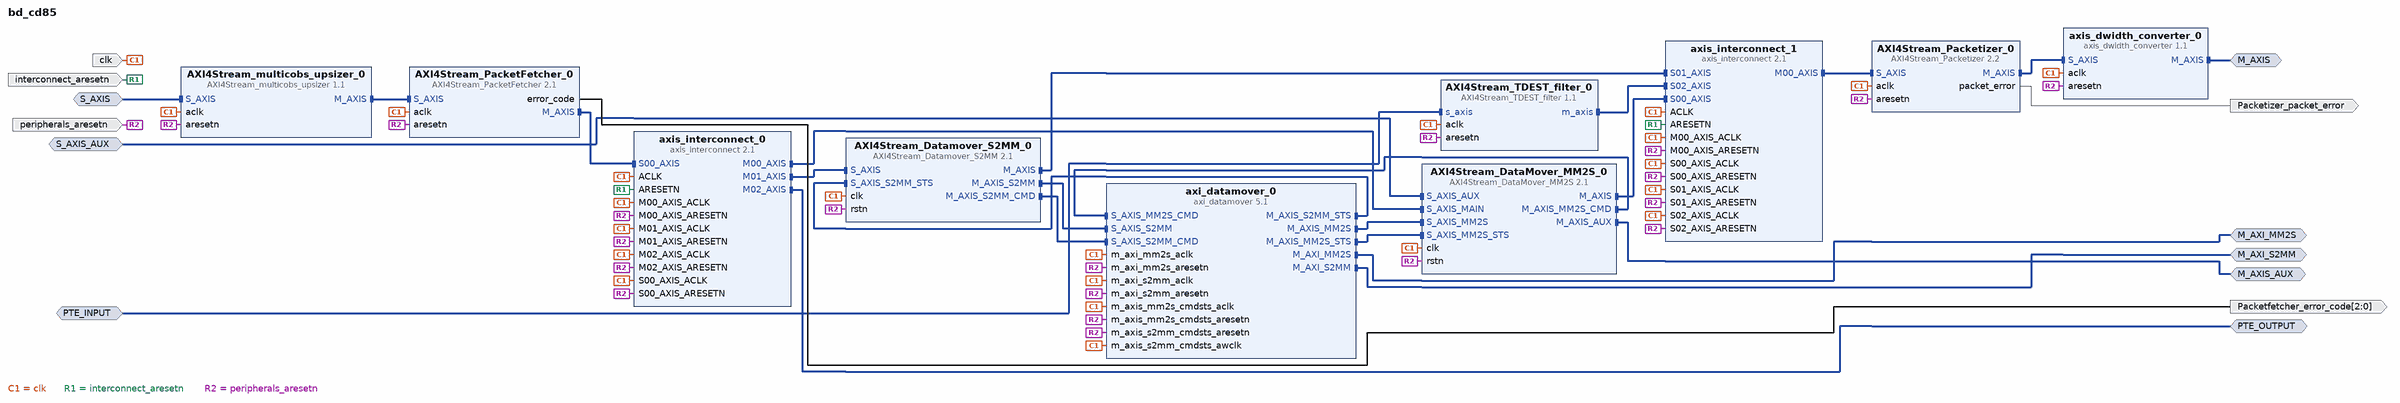
[diagram p0: block diagram of the top level]
# Vivado block design bd_cd85, xc7a100tftg256-2, Vivado 2020.2
create_bd_design bd_cd85

create_bd_intf_port -mode Slave -vlnv xilinx.com:interface:axis_rtl:1.0 S_AXIS
create_bd_intf_port -mode Slave -vlnv xilinx.com:interface:axis_rtl:1.0 S_AXIS_AUX
create_bd_intf_port -mode Master -vlnv xilinx.com:interface:axis_rtl:1.0 M_AXIS_AUX
create_bd_intf_port -mode Master -vlnv xilinx.com:interface:axis_rtl:1.0 M_AXIS
create_bd_intf_port -mode Master -vlnv xilinx.com:interface:aximm_rtl:1.0 M_AXI_MM2S
set_property -dict [list \
  CONFIG.ADDR_WIDTH 31 \
  CONFIG.MAX_BURST_LENGTH 256 \
  CONFIG.SUPPORTS_NARROW_BURST 0 \
] [get_bd_intf_ports M_AXI_MM2S]
create_bd_intf_port -mode Master -vlnv xilinx.com:interface:aximm_rtl:1.0 M_AXI_S2MM
set_property -dict [list \
  CONFIG.ADDR_WIDTH 31 \
  CONFIG.MAX_BURST_LENGTH 256 \
  CONFIG.SUPPORTS_NARROW_BURST 0 \
] [get_bd_intf_ports M_AXI_S2MM]
create_bd_intf_port -mode Master -vlnv xilinx.com:interface:axis_rtl:1.0 PTE_OUTPUT
create_bd_intf_port -mode Slave -vlnv xilinx.com:interface:axis_rtl:1.0 PTE_INPUT
create_bd_port -dir I -type clk clk
create_bd_port -dir I -type rst peripherals_aresetn
set_property -dict {CONFIG.POLARITY ACTIVE_LOW} [get_bd_ports peripherals_aresetn]
create_bd_port -dir I -type rst interconnect_aresetn
set_property -dict {CONFIG.POLARITY ACTIVE_LOW} [get_bd_ports interconnect_aresetn]
create_bd_port -dir O -from 2 -to 0 Packetfetcher_error_code
create_bd_port -dir O Packetizer_packet_error

create_bd_cell -type ip -vlnv DigiLAB:ip:AXI4Stream_DataMover_MM2S:2.1 AXI4Stream_DataMover_MM2S_0
set_property -dict [list \
  CONFIG.C_M_AXIS_MAIN_TDEST_WIDTH 8 \
  CONFIG.C_S_AXIS_MAIN_TDEST_WIDTH 8 \
  CONFIG.TDEST_ROUTING 0 \
] [get_bd_cells AXI4Stream_DataMover_MM2S_0]
create_bd_cell -type ip -vlnv DigiLAB:ip:AXI4Stream_Datamover_S2MM:2.1 AXI4Stream_Datamover_S2MM_0
set_property -dict {CONFIG.C_M_AXIS_TDEST_WIDTH 8 CONFIG.C_S_AXIS_TDEST_WIDTH 8} [get_bd_cells AXI4Stream_Datamover_S2MM_0]
create_bd_cell -type ip -vlnv DigiLAB:ip:AXI4Stream_PacketFetcher:2.1 AXI4Stream_PacketFetcher_0
set_property -dict {CONFIG.MAX_PACKET_LENGTH 4096} [get_bd_cells AXI4Stream_PacketFetcher_0]
create_bd_cell -type ip -vlnv DigiLAB:ip:AXI4Stream_Packetizer:2.2 AXI4Stream_Packetizer_0
set_property -dict {CONFIG.MAX_PACKET_LENGTH 131072 CONFIG.TDEST_WIDTH 8} [get_bd_cells AXI4Stream_Packetizer_0]
create_bd_cell -type ip -vlnv DigiLAB:ip:AXI4Stream_multicobs_upsizer:1.1 AXI4Stream_multicobs_upsizer_0
create_bd_cell -type ip -vlnv xilinx.com:ip:axi_datamover:5.1 axi_datamover_0
set_property -dict [list \
  CONFIG.c_dummy 1 \
  CONFIG.c_mm2s_btt_used 23 \
  CONFIG.c_mm2s_burst_size 256 \
  CONFIG.c_s2mm_btt_used 23 \
  CONFIG.c_s2mm_burst_size 256 \
] [get_bd_cells axi_datamover_0]
create_bd_cell -type ip -vlnv xilinx.com:ip:axis_dwidth_converter:1.1 axis_dwidth_converter_0
set_property -dict [list \
  CONFIG.HAS_TLAST 1 \
  CONFIG.M_TDATA_NUM_BYTES 1 \
  CONFIG.S_TDATA_NUM_BYTES 4 \
  CONFIG.TDEST_WIDTH 0 \
] [get_bd_cells axis_dwidth_converter_0]
create_bd_cell -type ip -vlnv xilinx.com:ip:axis_interconnect:2.1 axis_interconnect_0
set_property -dict {CONFIG.M02_AXIS_HIGHTDEST 0x000000FF CONFIG.NUM_MI 3 CONFIG.NUM_SI 1} [get_bd_cells axis_interconnect_0]
create_bd_cell -type ip -vlnv xilinx.com:ip:axis_interconnect:2.1 axis_interconnect_1
set_property -dict [list \
  CONFIG.ARB_ALGORITHM 3 \
  CONFIG.ARB_ON_MAX_XFERS 0 \
  CONFIG.ARB_ON_TLAST 1 \
  CONFIG.M00_AXIS_HIGHTDEST 0x000000FF \
  CONFIG.NUM_MI 1 \
  CONFIG.NUM_SI 3 \
] [get_bd_cells axis_interconnect_1]
create_bd_cell -type ip -vlnv DigiLAB:ip:AXI4Stream_TDEST_filter:1.1 AXI4Stream_TDEST_filter_0
set_property -dict {CONFIG.TDEST_WIDTH 8} [get_bd_cells AXI4Stream_TDEST_filter_0]

# ---- connections ----

connect_bd_intf_net [get_bd_intf_pins AXI4Stream_PacketFetcher_0/S_AXIS] [get_bd_intf_pins AXI4Stream_multicobs_upsizer_0/M_AXIS]
connect_bd_intf_net [get_bd_intf_pins AXI4Stream_Packetizer_0/M_AXIS] [get_bd_intf_pins axis_dwidth_converter_0/S_AXIS]
connect_bd_intf_net [get_bd_intf_pins AXI4Stream_DataMover_MM2S_0/M_AXIS_MM2S_CMD] [get_bd_intf_pins axi_datamover_0/S_AXIS_MM2S_CMD]
connect_bd_intf_net [get_bd_intf_ports M_AXIS_AUX] [get_bd_intf_pins AXI4Stream_DataMover_MM2S_0/M_AXIS_AUX]
connect_bd_intf_net [get_bd_intf_pins AXI4Stream_Datamover_S2MM_0/M_AXIS] [get_bd_intf_pins axis_interconnect_1/S01_AXIS]
connect_bd_intf_net [get_bd_intf_pins AXI4Stream_Datamover_S2MM_0/M_AXIS_S2MM] [get_bd_intf_pins axi_datamover_0/S_AXIS_S2MM]
connect_bd_intf_net [get_bd_intf_pins AXI4Stream_Datamover_S2MM_0/M_AXIS_S2MM_CMD] [get_bd_intf_pins axi_datamover_0/S_AXIS_S2MM_CMD]
connect_bd_intf_net [get_bd_intf_pins AXI4Stream_PacketFetcher_0/M_AXIS] [get_bd_intf_pins axis_interconnect_0/S00_AXIS]
connect_bd_intf_net [get_bd_intf_ports S_AXIS_AUX] [get_bd_intf_pins AXI4Stream_DataMover_MM2S_0/S_AXIS_AUX]
connect_bd_intf_net [get_bd_intf_pins AXI4Stream_DataMover_MM2S_0/S_AXIS_MM2S] [get_bd_intf_pins axi_datamover_0/M_AXIS_MM2S]
connect_bd_intf_net [get_bd_intf_pins AXI4Stream_DataMover_MM2S_0/S_AXIS_MM2S_STS] [get_bd_intf_pins axi_datamover_0/M_AXIS_MM2S_STS]
connect_bd_intf_net [get_bd_intf_pins AXI4Stream_Datamover_S2MM_0/S_AXIS_S2MM_STS] [get_bd_intf_pins axi_datamover_0/M_AXIS_S2MM_STS]
connect_bd_intf_net [get_bd_intf_ports M_AXI_MM2S] [get_bd_intf_pins axi_datamover_0/M_AXI_MM2S]
connect_bd_intf_net [get_bd_intf_ports M_AXI_S2MM] [get_bd_intf_pins axi_datamover_0/M_AXI_S2MM]
connect_bd_intf_net [get_bd_intf_pins AXI4Stream_DataMover_MM2S_0/S_AXIS_MAIN] [get_bd_intf_pins axis_interconnect_0/M00_AXIS]
connect_bd_intf_net [get_bd_intf_pins AXI4Stream_Datamover_S2MM_0/S_AXIS] [get_bd_intf_pins axis_interconnect_0/M01_AXIS]
connect_bd_intf_net [get_bd_intf_pins AXI4Stream_Packetizer_0/S_AXIS] [get_bd_intf_pins axis_interconnect_1/M00_AXIS]
connect_bd_intf_net [get_bd_intf_ports M_AXIS] [get_bd_intf_pins axis_dwidth_converter_0/M_AXIS]
connect_bd_intf_net [get_bd_intf_ports PTE_OUTPUT] [get_bd_intf_pins axis_interconnect_0/M02_AXIS]
connect_bd_intf_net [get_bd_intf_pins axis_interconnect_1/S02_AXIS] [get_bd_intf_pins AXI4Stream_TDEST_filter_0/m_axis]
connect_bd_intf_net -intf_net axis_filter_S00_AXIS [get_bd_intf_ports PTE_INPUT] [get_bd_intf_pins AXI4Stream_TDEST_filter_0/s_axis]
connect_bd_intf_net [get_bd_intf_ports S_AXIS] [get_bd_intf_pins AXI4Stream_multicobs_upsizer_0/S_AXIS]
connect_bd_intf_net [get_bd_intf_pins AXI4Stream_DataMover_MM2S_0/M_AXIS] [get_bd_intf_pins axis_interconnect_1/S00_AXIS]
connect_bd_net [get_bd_ports clk] \
  [get_bd_pins AXI4Stream_DataMover_MM2S_0/clk] [get_bd_pins AXI4Stream_Datamover_S2MM_0/clk] \
  [get_bd_pins AXI4Stream_PacketFetcher_0/aclk] [get_bd_pins AXI4Stream_Packetizer_0/aclk] \
  [get_bd_pins axi_datamover_0/m_axi_mm2s_aclk] [get_bd_pins axi_datamover_0/m_axi_s2mm_aclk] \
  [get_bd_pins axi_datamover_0/m_axis_mm2s_cmdsts_aclk] [get_bd_pins axi_datamover_0/m_axis_s2mm_cmdsts_awclk] \
  [get_bd_pins axis_interconnect_0/ACLK] [get_bd_pins axis_interconnect_1/ACLK] \
  [get_bd_pins axis_interconnect_0/M00_AXIS_ACLK] [get_bd_pins axis_interconnect_0/M01_AXIS_ACLK] \
  [get_bd_pins axis_interconnect_0/S00_AXIS_ACLK] [get_bd_pins axis_interconnect_1/S00_AXIS_ACLK] \
  [get_bd_pins axis_interconnect_1/S01_AXIS_ACLK] [get_bd_pins axis_interconnect_1/M00_AXIS_ACLK] \
  [get_bd_pins axis_interconnect_0/M02_AXIS_ACLK] [get_bd_pins axis_interconnect_1/S02_AXIS_ACLK] \
  [get_bd_pins AXI4Stream_TDEST_filter_0/aclk] [get_bd_pins axis_dwidth_converter_0/aclk] \
  [get_bd_pins AXI4Stream_multicobs_upsizer_0/aclk]
connect_bd_net [get_bd_ports interconnect_aresetn] [get_bd_pins axis_interconnect_0/ARESETN] [get_bd_pins axis_interconnect_1/ARESETN]
connect_bd_net [get_bd_ports peripherals_aresetn] \
  [get_bd_pins AXI4Stream_DataMover_MM2S_0/rstn] [get_bd_pins AXI4Stream_Datamover_S2MM_0/rstn] \
  [get_bd_pins AXI4Stream_PacketFetcher_0/aresetn] [get_bd_pins AXI4Stream_Packetizer_0/aresetn] \
  [get_bd_pins axi_datamover_0/m_axi_mm2s_aresetn] [get_bd_pins axi_datamover_0/m_axi_s2mm_aresetn] \
  [get_bd_pins axi_datamover_0/m_axis_mm2s_cmdsts_aresetn] [get_bd_pins axi_datamover_0/m_axis_s2mm_cmdsts_aresetn] \
  [get_bd_pins axis_interconnect_0/M00_AXIS_ARESETN] [get_bd_pins axis_interconnect_0/M01_AXIS_ARESETN] \
  [get_bd_pins axis_interconnect_0/S00_AXIS_ARESETN] [get_bd_pins axis_interconnect_1/S00_AXIS_ARESETN] \
  [get_bd_pins axis_interconnect_1/S01_AXIS_ARESETN] [get_bd_pins axis_interconnect_1/M00_AXIS_ARESETN] \
  [get_bd_pins axis_interconnect_0/M02_AXIS_ARESETN] [get_bd_pins axis_interconnect_1/S02_AXIS_ARESETN] \
  [get_bd_pins AXI4Stream_TDEST_filter_0/aresetn] [get_bd_pins axis_dwidth_converter_0/aresetn] \
  [get_bd_pins AXI4Stream_multicobs_upsizer_0/aresetn]
connect_bd_net -net error_code [get_bd_pins AXI4Stream_PacketFetcher_0/error_code] [get_bd_ports Packetfetcher_error_code]
connect_bd_net -net packet_error [get_bd_pins AXI4Stream_Packetizer_0/packet_error] [get_bd_ports Packetizer_packet_error]

# ---- address map ----
assign_bd_address -offset 0x00000000 -range 2G -target_address_space [get_bd_addr_spaces axi_datamover_0/Data_MM2S] [get_bd_addr_segs M_AXI_MM2S/Reg]
assign_bd_address -offset 0x00000000 -range 2G -target_address_space [get_bd_addr_spaces axi_datamover_0/Data_S2MM] [get_bd_addr_segs M_AXI_S2MM/Reg]

validate_bd_design
save_bd_design
